# Altium schematic sheet prom.SchDoc: PROM
size A; Engineer: A. Peck; Organization: UCLA High Energy Physics; DocumentNumber: 7; Revision: 3.0; SheetNumber: 7; SheetTotal: 15; Project: LCT Comparator Tester
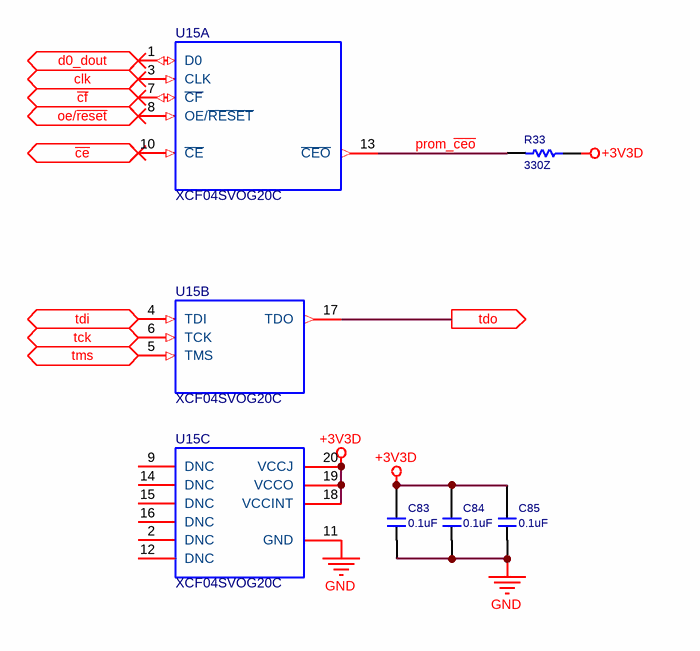
[diagram p0: prom.SchDoc]

## Parts
C83  0.1uF  [C0603]
C84  0.1uF  [C0603]
C85  0.1uF  [C0603]
R33  330Z  [R0603]
U15  XCF04SVOG20C  [R-PDSO-G20]  (parts A,B,C of 3)

## Ports
clk (in), d0_dout (out), oe/~{reset} (in), tck (in), tdi (in), tdo (out), tms (in), ~{ce} (in), ~{cf} (in)

## Nets
+3V3D: C83.2 C84.2 C85.2 R33.1 U15.18(VCCINT) U15.19(VCCO) U15.20(VCCJ)
GND: C83.1 C84.1 C85.1 U15.11(GND)
~{ce}: U15.10(~{CE}) ; port ~{ce}
~{cf}: U15.7(~{CF}) ; port ~{cf}
clk: U15.3(CLK) ; port clk
d0_dout: U15.1(D0) ; port d0_dout
oe/~{reset}: U15.8(OE/~{RESET}) ; port oe/~{reset}
prom_~{ceo}: R33.2 U15.13(~{CEO})
tck: U15.6(TCK) ; port tck
tdi: U15.4(TDI) ; port tdi
tdo: U15.17(TDO) ; port tdo
tms: U15.5(TMS) ; port tms

Not connected (* = marked no-connect by the designer): U15 2(DNC) 9(DNC) 12(DNC) 14(DNC) 15(DNC) 16(DNC)

## Notes on the sheet
- Date:
- Rev:
- of
- Sheet

## Library data of the parts
C83-C85 = CAP/06035C104KAT2A: CAP-CER, 2, 0.1uF, 10%, 50V, 0603, X7R; Manufacturer: AVX Corporation; Capacitance: 0.10µF; Supplier 1: Digi-Key; Supplier Part Number 1: 478-5052-1-ND; Manufacturer Part Number: 06035C104KAT2A; RoHS: RoHS Compliant; Category: Capacitors; Stock 1: 4412408; Pricing 1: 1=0.1, 10=0.036, 25=0.0264, 50=0.0198, 100=0.0162, 250=0.01352, 500=0.01156, 1000=0.00908 (USD); Packaging: Cut Tape (CT); Tolerance: ±10%; Voltage - Rated: 50V; Temperature Coefficient: X7R; Mounting Type: Surface Mount, MLCC; Operating Temperature: -55°C ~ 125°C; Applications: General Purpose; Ratings: -; Package / Case: 0603 (1608 Metric); Size / Dimension: 0.063" L x 0.032" W (1.60mm x 0.81mm); Height - Seated (Max): -; Thickness (Max): 0.035" (0.90mm); Lead Spacing: -; Features: -; Lead Style: -; ComponentLink1URL: http://datasheets.avx.com/X7RDielectric.pdf; ComponentLink1Description: http://datasheets.avx.com/X7RDielectric.pdf; Supplier 2: Newark; Supplier Part Number 2: 54K2412
R33 = CRCW0603330RFKEA: RES0, SMD,  330Z, 1.0%, 1/10W, 0603; Manufacturer: Rohm Semiconductor; Manufacturer Part Number: MCR03ERTF3300; Resistance (Ohms): 330; Tolerance: ±1%; Power (Watts): 0.1W, 1/10W; Temperature Coefficient: ±100ppm/°C; Supplier 1: Digi-Key; RoHS: RoHS Compliant; Category: Resistors; Stock 1: 139947; Pricing 1: 1=0.1, 10=0.011, 25=0.0084, 100=0.0047, 250=0.00356, 500=0.00286, 1000=0.0021 (USD); Packaging: Cut Tape (CT); Composition: Thick Film; Features: -; Operating Temperature: -55°C ~ 155°C; Package / Case: 0603 (1608 Metric); Supplier Device Package: 0603 (1608 Metric); Size / Dimension: 0.063" L x 0.031" W (1.60mm x 0.80mm); Height: 0.022" (0.55mm); Number of Terminations: 2; ComponentLink1URL: http://rohmfs.rohm.com/en/products/databook/datasheet/passive/resistor/chip_resistor/mcr_g.pdf; ComponentLink1Description: http://rohmfs.rohm.com/en/products/databook/datasheet/passive/resistor/chip_resistor/mcr_g.pdf; Supplier Part Number 1: RHM330CFCT-ND
U15 = XCF04SVOG20C TSSOP-20: PROM, 4M GATE, Platform Flash; Manufacturer: Xilinx Inc.; Programmable Type: In System Programmable; Memory Size: 4Mb; Voltage - Supply: 3 V ~ 3.6 V; Supplier 1: Digi-Key; Manufacturer Part Number: XCF04SVOG20C; RoHS: RoHS Compliant; Category: Integrated Circuits (ICs); Stock 1: 6188; Pricing 1: 1=7.21 (USD); Packaging: Tube; Part Status: Active; Operating Temperature: -40°C ~ 85°C; Package / Case: 20-TSSOP (0.173", 4.40mm Width); Supplier Device Package: 20-TSSOP; ComponentLink1URL: http://www.xilinx.com/support/documentation/data_sheets/ds123.pdf; ComponentLink1Description: http://www.xilinx.com/support/documentation/data_sheets/ds123.pdf; Supplier Part Number 1: 122-1288-5-ND